# EAGLE design SETBOARD (EAGLE 6.5.0)
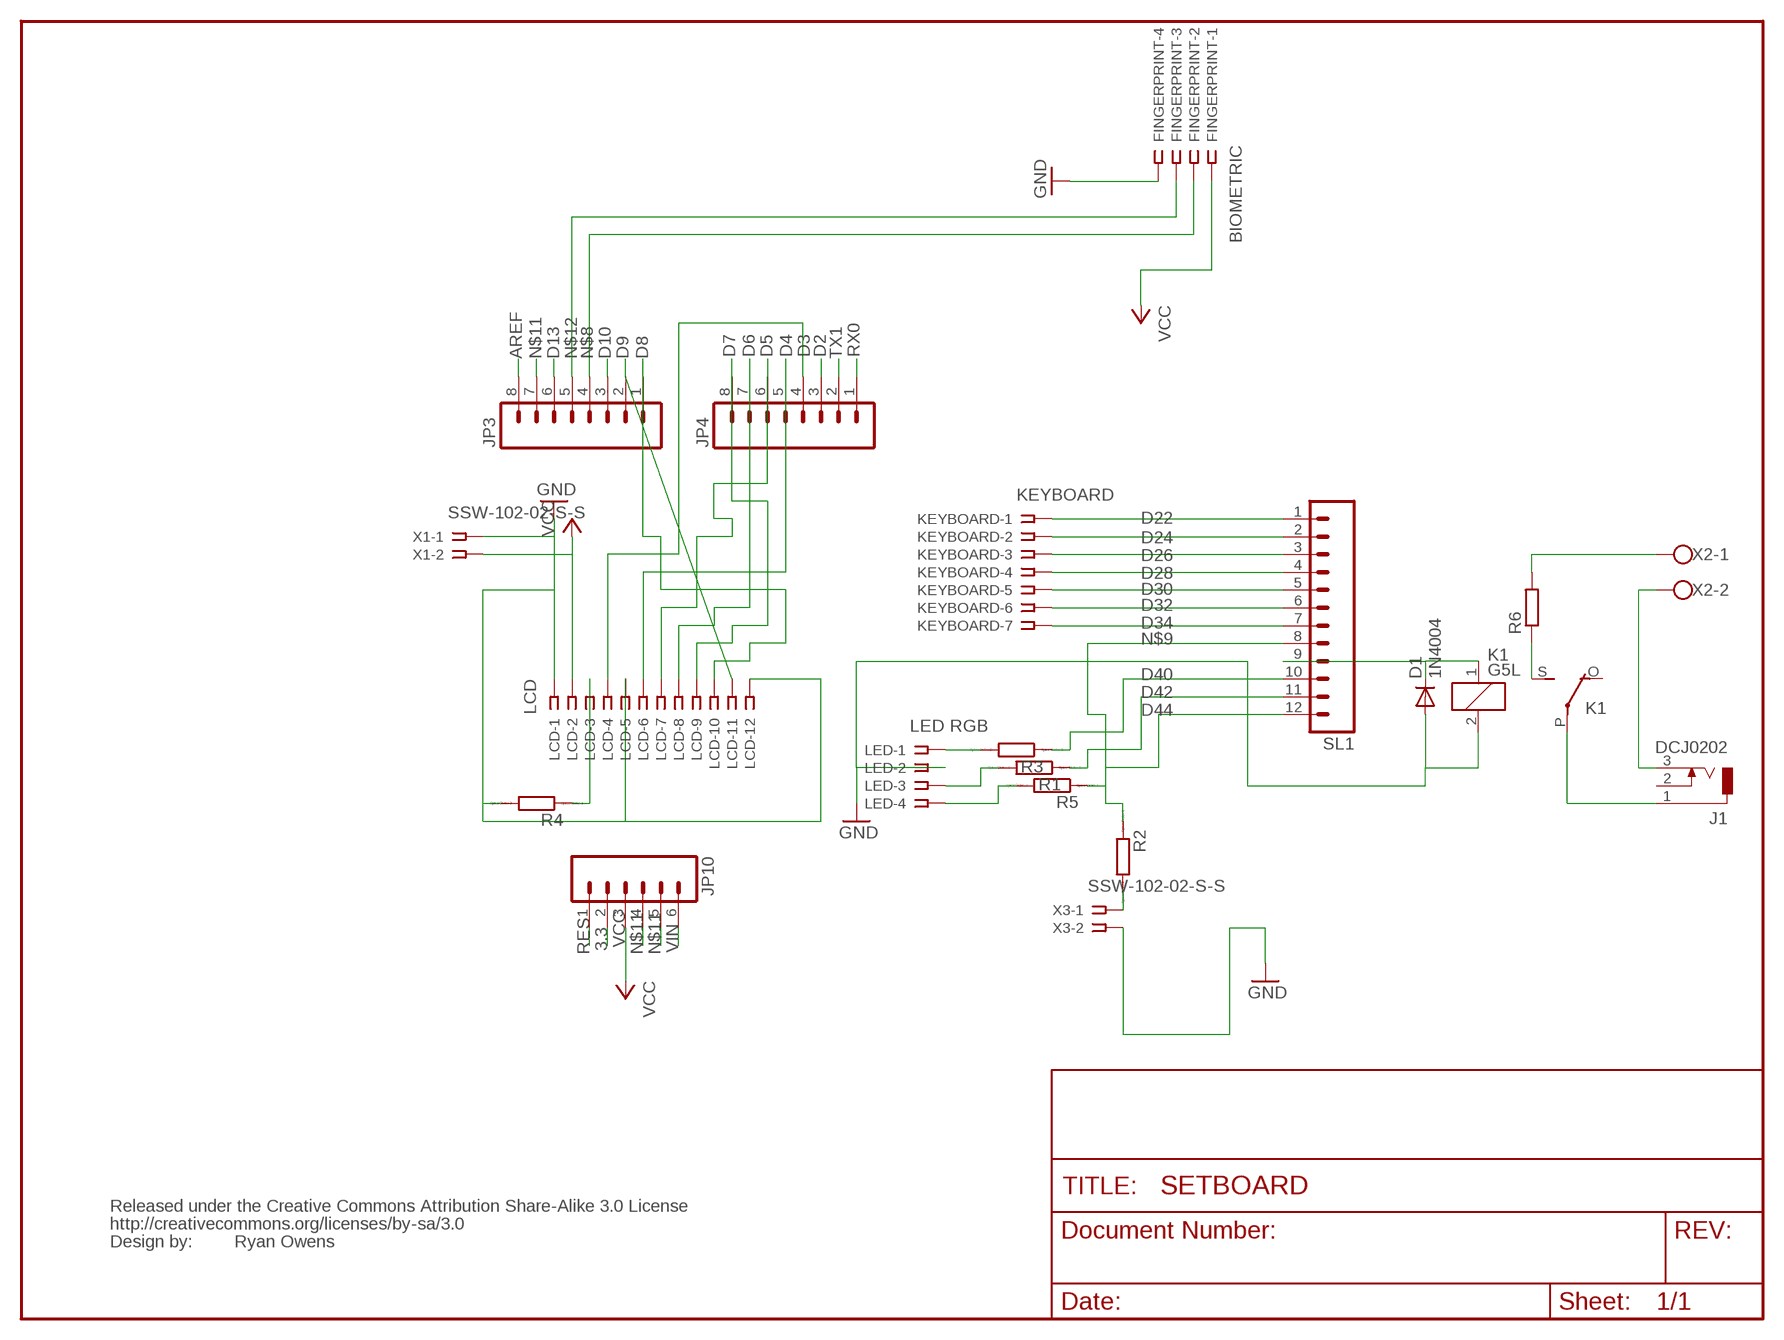
[diagram p0: schematic, sheet 1]

## Parts
D1  1N4004  [DO41-10]
FINGERPRINT  BIOMETRIC  SSW-104-02-S-S  [SSW-104-02-S-S]
J1  DCJ0202  [DCJ0202]
JP3  M08LOCK  [1X08_LOCK]
JP4  M08LOCK  [1X08_LOCK]
JP10  M06LOCK  [1X06_LOCK]
K1  G5L  [G5LE]
KEYBOARD  KEYBOARD  SSW-107-02-S-S  [SSW-107-02-S-S]
LCD  LCD  SSW-112-02-S-S  [SSW-112-02-S-S]
LED  LED RGB  SSW-104-02-S-S  [SSW-104-02-S-S]
R1  R0207/10  [0207/10]
R2  R0207/10  [0207/10]
R3  R0207/10  [0207/10]
R4  R0207/10  [0207/10]
R5  R0207/10  [0207/10]
R6  R-EU_0817/22  [P0817/22]
SL1  M12  [12P]
U$2  CREATIVE_COMMONS  [CREATIVE_COMMONS]
X1  SSW-102-02-S-S  [SSW-102-02-S-S]
X2  W237-102  [W237-102]
X3  SSW-102-02-S-S  [SSW-102-02-S-S]

## Nets
3.3: JP10.2
AREF: JP3.8
D2: JP4.3
D3: JP4.4 LCD.4
D4: JP4.5 LCD.6
D5: JP4.6 LCD.7
D6: JP4.7 LCD.8
D7: JP4.8 LCD.9
D8: JP3.1 LCD.10
D9: JP3.2 LCD.11
D10: JP3.3
D13: JP3.6
D22: KEYBOARD.1 SL1.1
D24: KEYBOARD.2 SL1.2
D26: KEYBOARD.3 SL1.3
D28: KEYBOARD.4 SL1.4
D30: KEYBOARD.5 SL1.5
D32: KEYBOARD.6 SL1.6
D34: KEYBOARD.7 SL1.7
D40: R3.1 SL1.10
D42: R1.1 SL1.11
D44: R5.1 SL1.12
N$1: LCD.3 R4.1
N$2: LED.1 R3.2
N$3: LED.3 R1.2
N$4: LED.4 R5.2
N$5: R2.2 X3.1
N$7: D1.C K1.1 SL1.9
N$8: FINGERPRINT.2 JP3.4
N$9: R2.1 SL1.8
N$11: D1.A FINGERPRINT.4 JP3.7 JP10.4 JP10.5 K1.2 LCD.1 LCD.5 LCD.12 LED.2 R4.2 X1.1 X3.2 ; supply symbol labelled GND
N$12: FINGERPRINT.3 JP3.5
N$14: K1.S(2:S) R6.1
N$16: J1.3 X2.2
N$17: J1.1 K1.P(2:P)
N$20: R6.2 X2.1
RES: JP10.1
RX0: JP4.1
TX1: JP4.2
VCC: FINGERPRINT.1 JP10.3 LCD.2 X1.2
VIN: JP10.6
Unconnected: J1.2 K1.O(2:O)

## Notes on the sheet
- Ryan Owens

## Library data of the parts
D1 = diode:1N4004: DIODE general purpose rectifier, 1 A
FINGERPRINT LED = con-samtec:SSW-104-02-S-S: THROUGH-HOLE .025" SQ POST SOCKET Source: Samtec SSW.pdf; MPN: SSW-104-02-S-S; OC_FARNELL: unknown; OC_NEWARK: 11P9384
J1 = con-jack:DCJ0202: DC POWER JACK Source: DCJ0202.pdf; OC_FARNELL: unknown; OC_NEWARK: unknown
JP3 JP4 = SparkFun:M08: Header 8 Standard 8-pin 0.1" header. Use with straight break away headers (SKU : PRT-00116), right angle break away headers (PRT-00553), swiss pins (PRT-00743), machine pins (PRT-00117), and female headers (PRT-00115).
JP10 = SparkFun:M06: Header 6 Standard 6-pin 0.1" header. Use with straight break away headers (SKU : PRT-00116), right angle break away headers (PRT-00553), swiss pins (PRT-00743), machine pins (PRT-00117), and female headers (PRT-00115). Molex polarized connector foot print use with SKU : PRT-08094 with associated crimp pins and housings. NOTES ON THE VARIANTS LOCK and LOCK_LONGPADS... This footprint was designed to help hold the alignment of a through-hole component (i.e. 6-pin header) while soldering it into place. You may notice that each hole has been shifted either up or down by 0.005 of an inch from it's more standard position (which is a perfectly straight line). This slight alteration caused the pins (the squares in the middle) to touch the edges of the holes. Because they are alternating, it causes a "brace" to hold the component in place. 0.005 has proven to be the perfect amount of "off-center" position when using our standard breakaway headers. Although looks a little odd when you look at the bare footprint, once you have a header in there, the alteration is very hard to notice. Also, if you push a header all the way into place, it is covered up entirely on the bottom side. This idea of altering the position of holes to aid alignment will be further integrated into the Sparkfun Library for other footprints. It can help hold any component with 3 or more connection pins.
K1 = relay:G5L: RELAY 1 x switch, 10 A/120 V AC, 8 A/30 V ADC, Omron; OC_FARNELL: unknown; OC_NEWARK: unknown
KEYBOARD = con-samtec:SSW-107-02-S-S: THROUGH-HOLE .025" SQ POST SOCKET Source: Samtec SSW.pdf; MPN: SSW-107-02-S-S; OC_FARNELL: unknown; OC_NEWARK: 11P9433
LCD = con-samtec:SSW-112-02-S-S: THROUGH-HOLE .025" SQ POST SOCKET Source: Samtec SSW.pdf; MPN: SSW-112-02-S-S; OC_FARNELL: unknown; OC_NEWARK: 11P9515
R1-R5 = eagle-ltspice:R: RESISTOR, European symbol; SPICEMODEL: NONE; SPICEPREFIX: R
R6 = resistor:R-EU_: RESISTOR, European symbol
SL1 = con-amp-quick:M12: AMP QUICK CONNECTOR; OC_FARNELL: unknown; OC_NEWARK: unknown
U$2 = SparkFun:CREATIVE_COMMONS
X1 X3 = con-samtec:SSW-102-02-S-S: THROUGH-HOLE .025" SQ POST SOCKET Source: Samtec SSW.pdf; MPN: SSW-102-02-S-S; OC_FARNELL: unknown; OC_NEWARK: 11P9351
X2 = con-wago-500:W237-102: WAGO SCREW CLAMP; MPN: 237-102; OC_FARNELL: unknown; OC_NEWARK: 70K9898

## Board
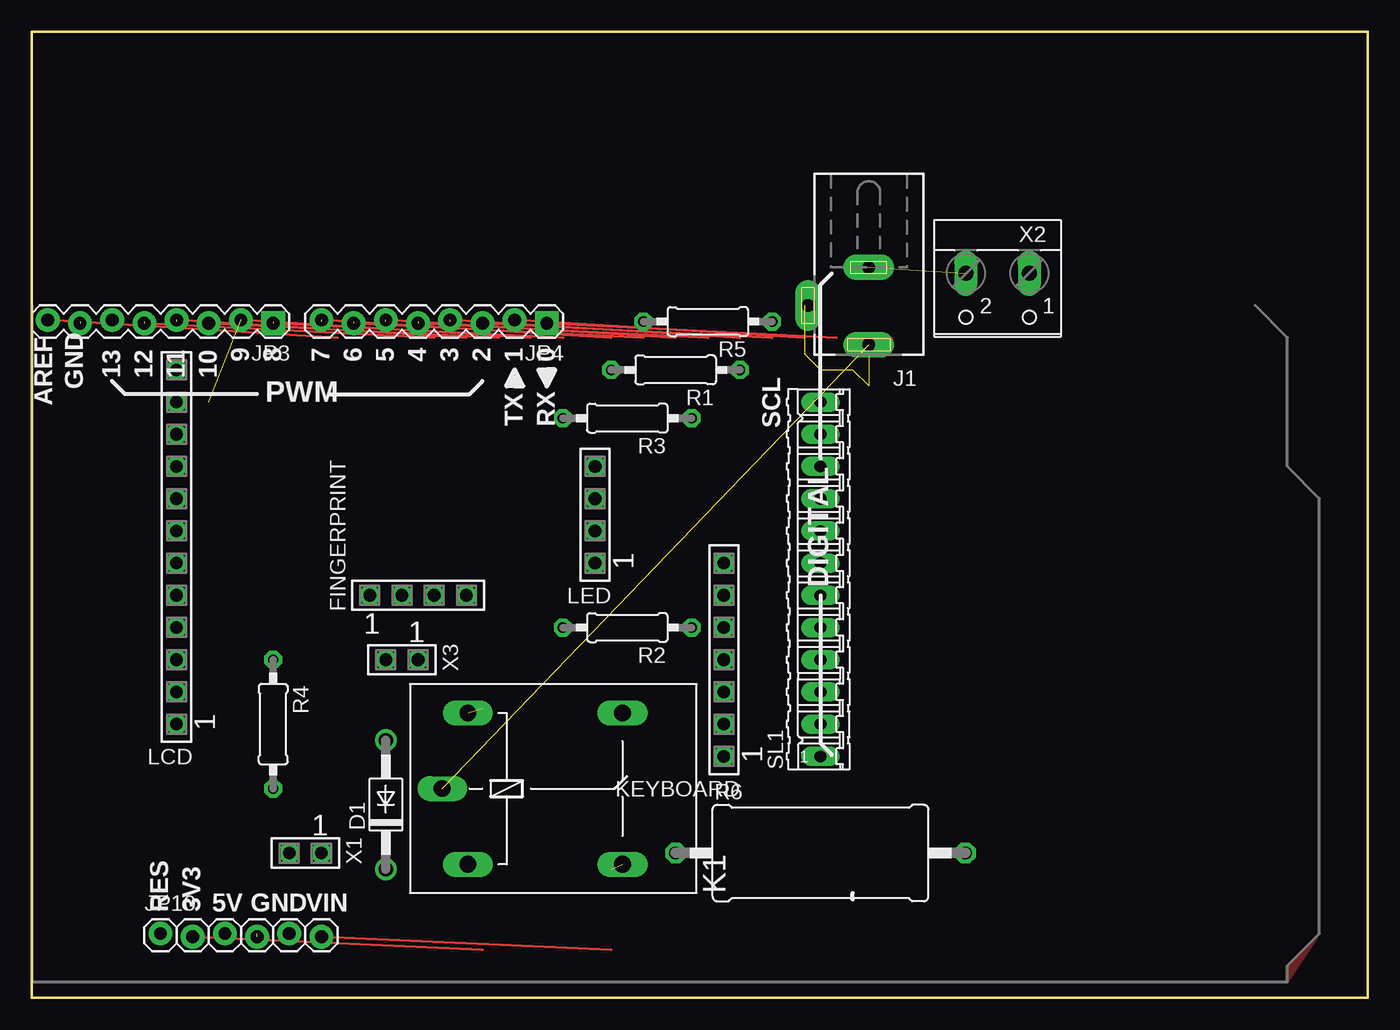
[diagram p1: board, top side]
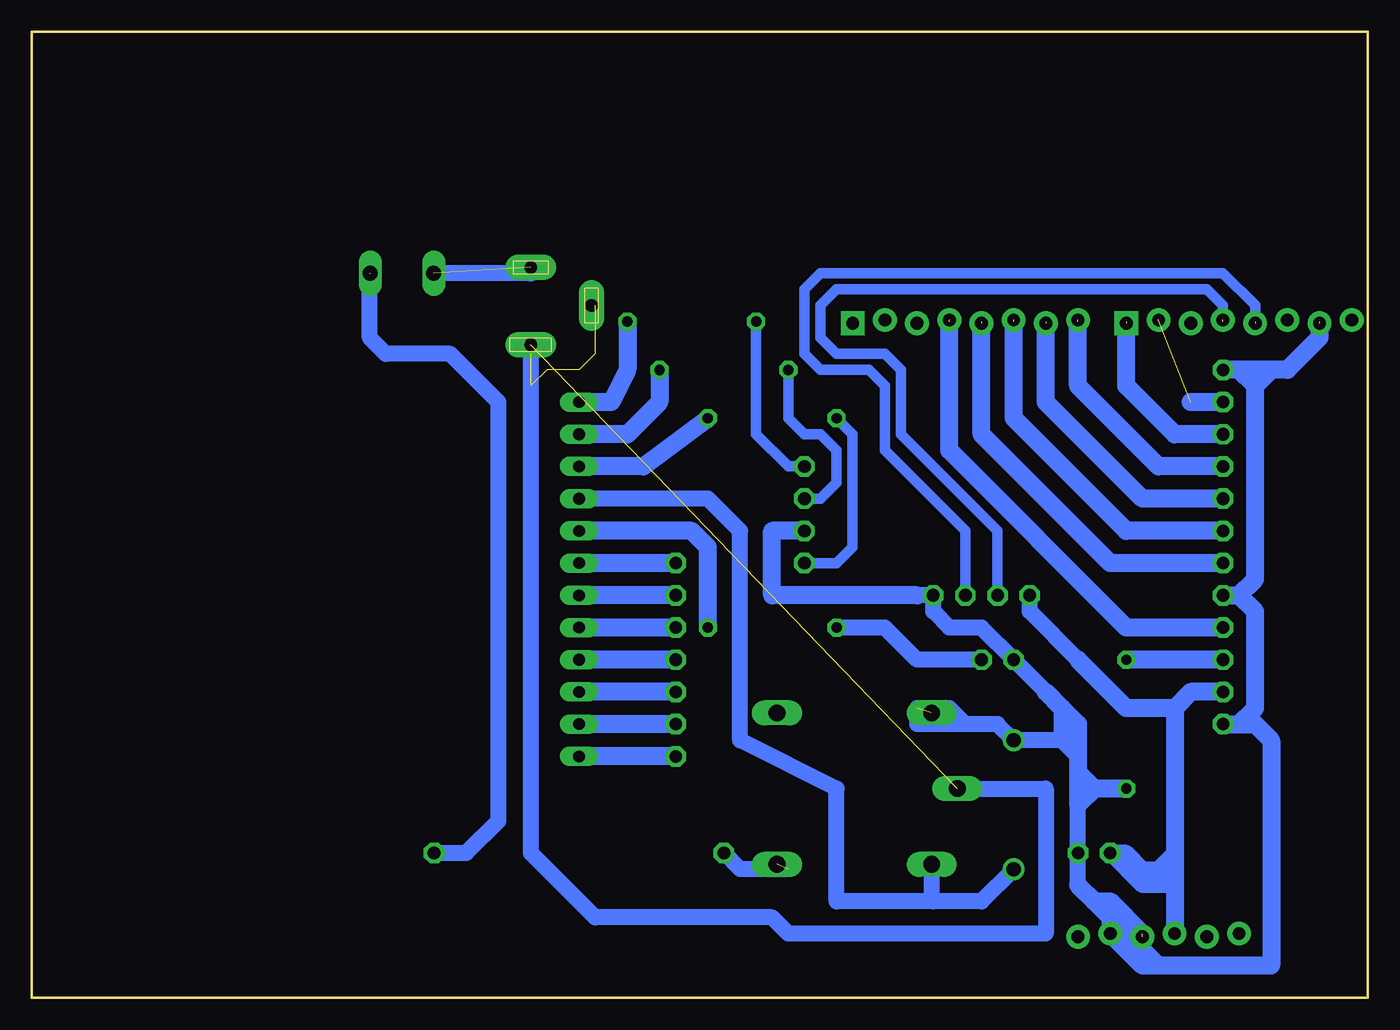
[diagram p2: board, bottom side, seen from below]

Size 105.41 x 76.2 mm. Coordinates in mm from the lower left corner, seen from the top.
Outline: 0,0 105.41,0 105.41,76.2 0,76.2 0,0
Copper layers (1*16): Top 0.035mm / dielectric 1.5mm / Bottom 0.035mm
Design rules "SparkFun": minimum track width 8mil, minimum drill 20mil, track to track 8mil, track to pad 8mil, pad to pad 8mil, via to via 8mil, smd to smd 8mil, copper to edge 10mil, drill to drill 8mil, minimum pad ring 12mil, minimum via ring 10mil, stop-mask expansion 4mil, vias tented up to drill 25mil, thermal gap 10mil

### Footprints (pad centres in the part's own frame; a part is rotated, then mirrored left to right if it is on the bottom)
DO41-10 = drill 1.118: A 5.08,0; C -5.08,0
SSW-104-02-S-S = drill 1 pad 1.5 octagon: 1 -3.81,0; 2 -1.27,0; 3 1.27,0; 4 3.81,0
DCJ0202 = drill 1 pad 2 long: 1 0,3.1; 2 4.8,0; 3 0,-3
1X08_LOCK = drill 1.016 pad 1.88 square: 1 0,0.127 | drill 1.016 pad 1.88: 2 2.54,-0.127; 3 5.08,0.127; 4 7.62,-0.127; 5 10.16,0.127; 6 12.7,-0.127; 7 15.24,0.127; 8 17.78,-0.127
1X06_LOCK = drill 1.016 pad 1.88: 1 0,0; 2 2.54,-0.254; 3 5.08,0; 4 7.62,-0.254; 5 10.16,0; 6 12.7,-0.254
G5LE = drill 1.321 long: 1 -7.493,-5.969; 2 -7.493,5.969; O 4.699,5.969; P -9.525,0; S 4.699,-5.969
SSW-107-02-S-S = drill 1 pad 1.5 octagon: 1 -7.62,0; 2 -5.08,0; 3 -2.54,0; 4 0,0; 5 2.54,0; 6 5.08,0; 7 7.62,0
SSW-112-02-S-S = drill 1 pad 1.5 octagon: 1 -13.97,0; 2 -11.43,0; 3 -8.89,0; 4 -6.35,0; 5 -3.81,0; 6 -1.27,0; 7 1.27,0; 8 3.81,0; 9 6.35,0; 10 8.89,0; 11 11.43,0; 12 13.97,0
0207/10 = drill 0.813 octagon: 1 -5.08,0; 2 5.08,0
P0817/22 = drill 1.016 octagon: 1 -11.43,0; 2 11.43,0
12P = drill 0.914 long: 1 -13.97,0; 2 -11.43,0; 3 -8.89,0; 4 -6.35,0; 5 -3.81,0; 6 -1.27,0; 7 1.27,0; 8 3.81,0; 9 6.35,0; 10 8.89,0; 11 11.43,0; 12 13.97,0
SSW-102-02-S-S = drill 1 pad 1.5 octagon: 1 -1.27,0; 2 1.27,0
W237-102 = drill 1.194 long: 1 -2.5,-1.27; 2 2.5,-1.27

### Placement (x,y rotation side)
D1  27.94,15.24 90 top
FINGERPRINT  30.48,31.75 0 top
J1  66.04,54.61 180 top
JP3  19.05,53.34 180 top
JP4  40.64,53.34 180 top
JP10  10.16,5.08 0 top
K1  41.91,16.51 0 top
KEYBOARD  54.61,26.67 90 top
LCD  11.43,35.56 90 top
LED  44.45,38.1 90 top
R1  50.8,49.53 180 top
R2  46.99,29.21 180 top
R3  46.99,45.72 180 top
R4  19.05,21.59 270 top
R5  53.34,53.34 180 top
R6  62.23,11.43 0 top
SL1  62.23,33.02 90 top
U$2  -13.97,-13.97 0 top  (outside the outline)
X1  21.59,11.43 180 top
X2  76.2,55.88 180 top
X3  29.21,26.67 180 top

### Tracks (layer width: path | path; a pad name or v marks a point on that pad's centre or on a via)
3.3
  Top 0.203: JP10.2 35.56,3.81
AREF
  Top 0.203: JP3.8 24.13,52.07
D2
  Top 0.203: JP4.3 58.42,52.07
D3  (1 unrouted)
  Top 0.203: JP4.4 55.88,52.07
  Bottom 1.422: LCD.4 19.05,29.21 33.02,43.18 33.02,53.34
D4  (1 unrouted)
  Top 0.203: JP4.5 53.34,52.07
  Bottom 1.422: LCD.6 20.32,34.29 30.48,44.45 30.48,53.34
D5  (1 unrouted)
  Top 0.203: JP4.6 50.8,52.07
  Bottom 1.422: LCD.7 19.05,36.83 27.94,45.72 27.94,53.34
D6  (1 unrouted)
  Top 0.203: JP4.7 48.26,52.07
  Bottom 1.422: LCD.8 17.78,39.37 25.4,46.99 25.4,53.34
D7  (1 unrouted)
  Top 0.203: JP4.8 45.72,52.07
  Bottom 1.422: LCD.9 16.51,41.91 22.86,48.26 22.86,53.34
D8  (1 unrouted)
  Top 0.203: JP3.1 41.91,52.07
  Bottom 1.422: LCD.10 15.24,44.45 19.05,48.26 19.05,53.34
D9  (1 unrouted)
  Top 0.203: JP3.2 39.37,52.07
  Bottom 1.422: LCD.11 13.97,46.99
D10
  Top 0.203: JP3.3 36.83,52.07
D22
  Bottom 1.422: KEYBOARD.1 SL1.1
D24
  Bottom 1.422: KEYBOARD.2 SL1.2
D26
  Bottom 1.422: KEYBOARD.3 SL1.3
D28
  Bottom 1.422: KEYBOARD.4 SL1.4
D30
  Bottom 1.422: KEYBOARD.5 SL1.5
D32
  Bottom 1.422: KEYBOARD.6 SL1.6
D34
  Bottom 1.422: KEYBOARD.7 SL1.7
D40
  Bottom 1.422: R3.1 57.15,41.91 SL1.10
D42
  Bottom 1.422: R1.1 55.88,46.99 58.42,44.45 SL1.11
D44
  Bottom 1.422: R5.1 58.42,49.53 59.69,46.99 SL1.12
N$1
  Bottom 1.422: LCD.3 R4.1
N$2
  Bottom 0.813: R3.2 40.64,44.45 40.64,35.56 41.91,34.29 LED.1
N$3
  Bottom 0.813: LED.3 43.18,39.37 41.91,40.64 41.91,43.18 43.18,44.45 44.45,44.45 45.72,45.72 R1.2
N$4
  Bottom 0.813: LED.4 45.72,41.91 48.26,44.45 R5.2
N$5
  Bottom 1.27: X3.1 35.56,26.67 38.1,29.21 R2.2
N$7
  Bottom 1.27: D1.C 30.48,7.62 34.29,7.62 | 34.29,7.62 41.91,7.62 41.91,16.51 49.53,20.32 49.53,36.83 52.07,39.37 SL1.9 | K1.1 34.42,7.75 34.29,7.62
N$8  (1 unrouted)
  Top 0.203: JP3.4 34.29,52.07
  Bottom 0.813: 11.43,53.34 11.43,54.61 12.7,55.88 41.91,55.88 43.18,54.61 43.18,52.07 41.91,50.8 38.1,50.8 36.83,49.53 36.83,44.45 29.21,36.83 FINGERPRINT.2
N$9
  Bottom 1.422: R2.1 52.07,35.56 53.34,36.83 SL1.8
N$11  (3 unrouted)
  Bottom 1.27: 22.86,8.89 X1.1 | X1.1 22.86,15.24 | 22.86,20.32 24.13,20.32 | 24.13,20.32 D1.A 29.21,21.59 31.75,21.59 | X1.1 22.86,19.05 24.13,20.32 | 25.4,24.13 X3.2 30.48,29.21 33.02,29.21 34.29,30.48 FINGERPRINT.4 35.56,31.75 | 31.75,21.59 33.02,22.86 35.56,22.86 35.56,21.59 31.75,21.59 | 24.13,20.32 24.13,22.86
  Bottom 1.422: 3.81,53.34 3.81,52.07 6.35,49.53 7.62,49.53 | 16.51,2.54 17.78,3.81 17.78,5.08 | 22.86,8.89 21.59,7.62 | 21.59,7.62 20.32,7.62 | 20.32,7.62 20.32,6.35 | 17.78,5.08 JP10.5 | 20.32,6.35 21.59,7.62 | 17.78,5.08 20.32,7.62 | JP10.5 17.78,2.54 16.51,2.54 | 20.32,6.35 JP10.5 | 22.86,17.78 22.86,19.05 22.86,20.32 22.86,21.59 24.13,22.86 25.4,24.13 | 22.86,17.78 22.86,16.51 | 22.86,16.51 22.86,15.24 21.59,16.51 | LED.2 46.99,36.83 46.99,31.75 35.56,31.75 | R4.2 21.59,16.51 | 21.59,16.51 22.86,16.51 | 21.59,16.51 22.86,17.78 | LCD.1 10.16,21.59 | 10.16,21.59 8.89,21.59 7.62,20.32 7.62,2.54 16.51,2.54 | 10.16,21.59 8.89,22.86 8.89,30.48 10.16,31.75 | LCD.5 10.16,31.75 | 10.16,31.75 8.89,33.02 8.89,48.26 | 8.89,48.26 10.16,49.53 | 10.16,49.53 LCD.12 | 7.62,49.53 10.16,49.53 | 7.62,49.53 8.89,48.26
  pour Top (isolate 0.305): 99.06,1.27 99.06,2.54 101.6,5.08
N$12  (1 unrouted)
  Top 0.203: JP3.5 31.75,52.07
  Bottom 0.813: 8.89,53.34 8.89,54.61 11.43,57.15 43.18,57.15 44.45,55.88 44.45,50.8 43.18,49.53 39.37,49.53 38.1,48.26 38.1,43.18 31.75,36.83 FINGERPRINT.3
N$14  (1 unrouted)
  Bottom 1.27: 45.72,10.16 49.53,10.16 R6.1
N$15  (5 unrouted)
  Bottom 1.27: 33.02,16.51 25.4,16.51 25.4,5.08 45.72,5.08 46.99,6.35 60.96,6.35 66.04,11.43 66.04,50.8
N$16  (1 unrouted)
N$17  (1 unrouted)
N$20  (1 unrouted)
  Bottom 1.27: R6.2 71.12,11.43 68.58,13.97 68.58,46.99 72.39,50.8 77.47,50.8 78.74,52.07 78.74,57.15
N$21
  Bottom 1.27: 66.04,57.15 73.66,57.15
RX0
  Top 0.203: JP4.1 63.5,52.07
TX1
  Top 0.203: JP4.2 60.96,52.07
VCC
  Bottom 1.27: 15.24,8.89 16.51,8.89 | 16.51,8.89 17.78,10.16 | 17.78,10.16 19.05,11.43 X1.2 17.78,8.89 16.51,8.89 | 16.51,8.89 15.24,10.16 15.24,11.43 16.51,10.16 17.78,10.16 | 22.86,26.67 26.67,30.48 FINGERPRINT.1
  Bottom 1.422: LCD.2 13.97,24.13 15.24,22.86 | 15.24,22.86 15.24,11.43 15.24,8.89 JP10.3 | 15.24,22.86 19.05,22.86 22.86,26.67
VIN
  Top 0.203: JP10.6 45.72,3.81

### Text on the board
Bottom: SetFinger 1.0 | GT-SET/CTIC
tPlace: 9 | 8 | 7 | 6 | 5 | 4 | 3 | 2 | 1 | 0 | 13 | 12 | 11 | 10 | GND | PWM | AREF | TX | RX | SCL | DIGITAL | RES | 3V3 | 5V | GND | VIN
tOrigins: led- -> gnd | led+ -> 5v | DB7 -> 8 | DB6 -> 7 | DB5 -> 6 | DB4 -> 5 | E -> 4 | R/W -> gnd | VCC | RX | TX | GND | RS -> 3 | V0~>gnd | vcc -> vcc | gnd -> gnd